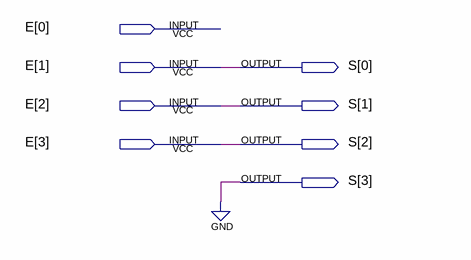
[diagram p0: schematic sheet]
// Quartus schematic shift_r.bdf as structural Verilog: 0 symbols, 8 pins
module shift_r (
  input  [3:0] E,
  output [3:0] S
);


  assign S = {1'b0, E[3:1]};
endmodule
